# EAGLE design haystack_rgb_single_wires_no_res (EAGLE 9.1.0)
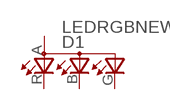
[diagram p0: schematic, sheet 1]

## Parts
D1  LEDRGBNEW  [P-LCC-4]
Unconnected: D1.A(A2) D1.B(CBLUE) D1.G(CGREEN) D1.R(CRED)

## Library data of the parts
D1 = fab :LEDRGBNEW

## Board
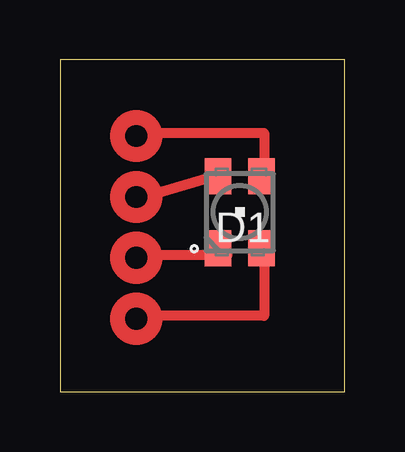
[diagram p1: board, top side]
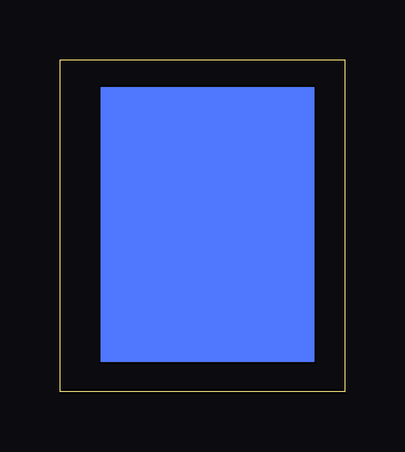
[diagram p2: board, bottom side, seen from below]

Size 11.86 x 13.83 mm. Coordinates in mm from the lower left corner, seen from the top.
Outline: 0,0 11.86,0 11.86,13.83 0,13.83 0,0
Copper layers (1*16): Top 0.035mm / dielectric 1.5mm / Bottom 0.035mm
Design rules "default": minimum track width 6mil, minimum drill 0.35mm, track to track 6mil, track to pad 6mil, pad to pad 6mil, via to via 6mil, smd to smd 6mil, copper to edge 40mil, drill to drill 6mil, minimum pad ring 10mil, minimum via ring 8mil, stop-mask expansion 4mil, vias tented up to drill 0mil, thermal gap 10mil

### Footprints (pad centres in the part's own frame; a part is rotated, then mirrored left to right if it is on the bottom)
P-LCC-4 = smd 1.1 x 1.5: A 0.902,-1.5; B 0.902,1.5; G -0.902,1.5; R -0.902,-1.5

### Placement (x,y rotation side)
D1  7.49,7.49 0 top

### Tracks (layer width: path | path; a pad name or v marks a point on that pad's centre or on a via)
N$1
  Top 0.406: 3.94,10.79 8.51,10.79 8.51,9.27
N$2
  Top 0.406: 8.51,5.97 8.51,3.17 3.94,3.17
N$8
  Top 0.406: 3.94,8 3.94,8.26 6.48,9.02
N$9
  Top 0.406: 4.19,5.71 6.99,5.71
(copper drawn outside any net)
  shapes: Bottom area x1, Top circle x4